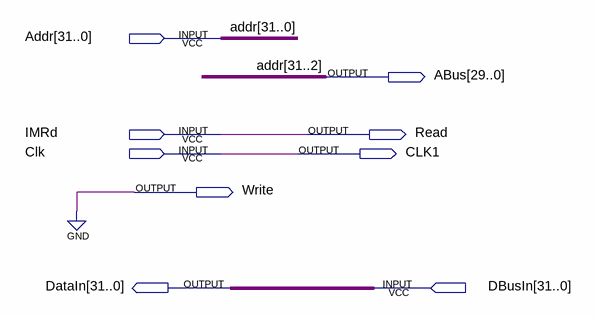
[diagram p0: schematic sheet]
// Quartus schematic IBIU.bdf as structural Verilog: 0 symbols, 9 pins
module IBIU (
  input  [31:0] Addr,
  input  IMRd,
  input  Clk,
  input  [31:0] DBusIn,
  output [29:0] ABus,
  output Read,
  output CLK1,
  output Write,
  output [31:0] DataIn
);


  assign ABus = Addr[31:2];
  assign CLK1 = Clk;
  assign DataIn = DBusIn;
  assign Read = IMRd;
  assign Write = 1'b0;
endmodule
